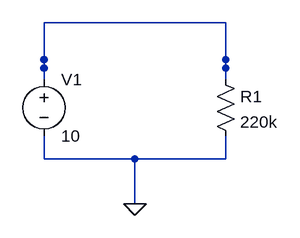
[diagram p0: schematic pannel1.asc]
pannel1.asc, the LTspice schematic file:
Version 4
SHEET 1 880 680
WIRE 640 400 640 372
WIRE 640 512 640 480
SYMBOL res 624 384 R0
SYMATTR InstName R1
SYMATTR Value 220k
FLAG 512 576 0
WIRE 384 400 384 372
WIRE 384 512 384 480
SYMBOL voltage 384 384 R0
SYMATTR InstName V1
SYMATTR Value 10
WIRE 384 320 448 320
WIRE 384 320 384 384
WIRE 640 320 640 384
WIRE 576 320 640 320
WIRE 576 512 640 512
WIRE 512 512 576 512
WIRE 512 512 512 576
WIRE 448 512 512 512
WIRE 384 512 448 512
WIRE 448 320 512 320
WIRE 512 320 576 320

The netlist it stands for:
* pannel1.asc
R1 N001 0 220k
V1 N001 0 10
.backanno
.end